# EAGLE design receiver (EAGLE 7.2.0)
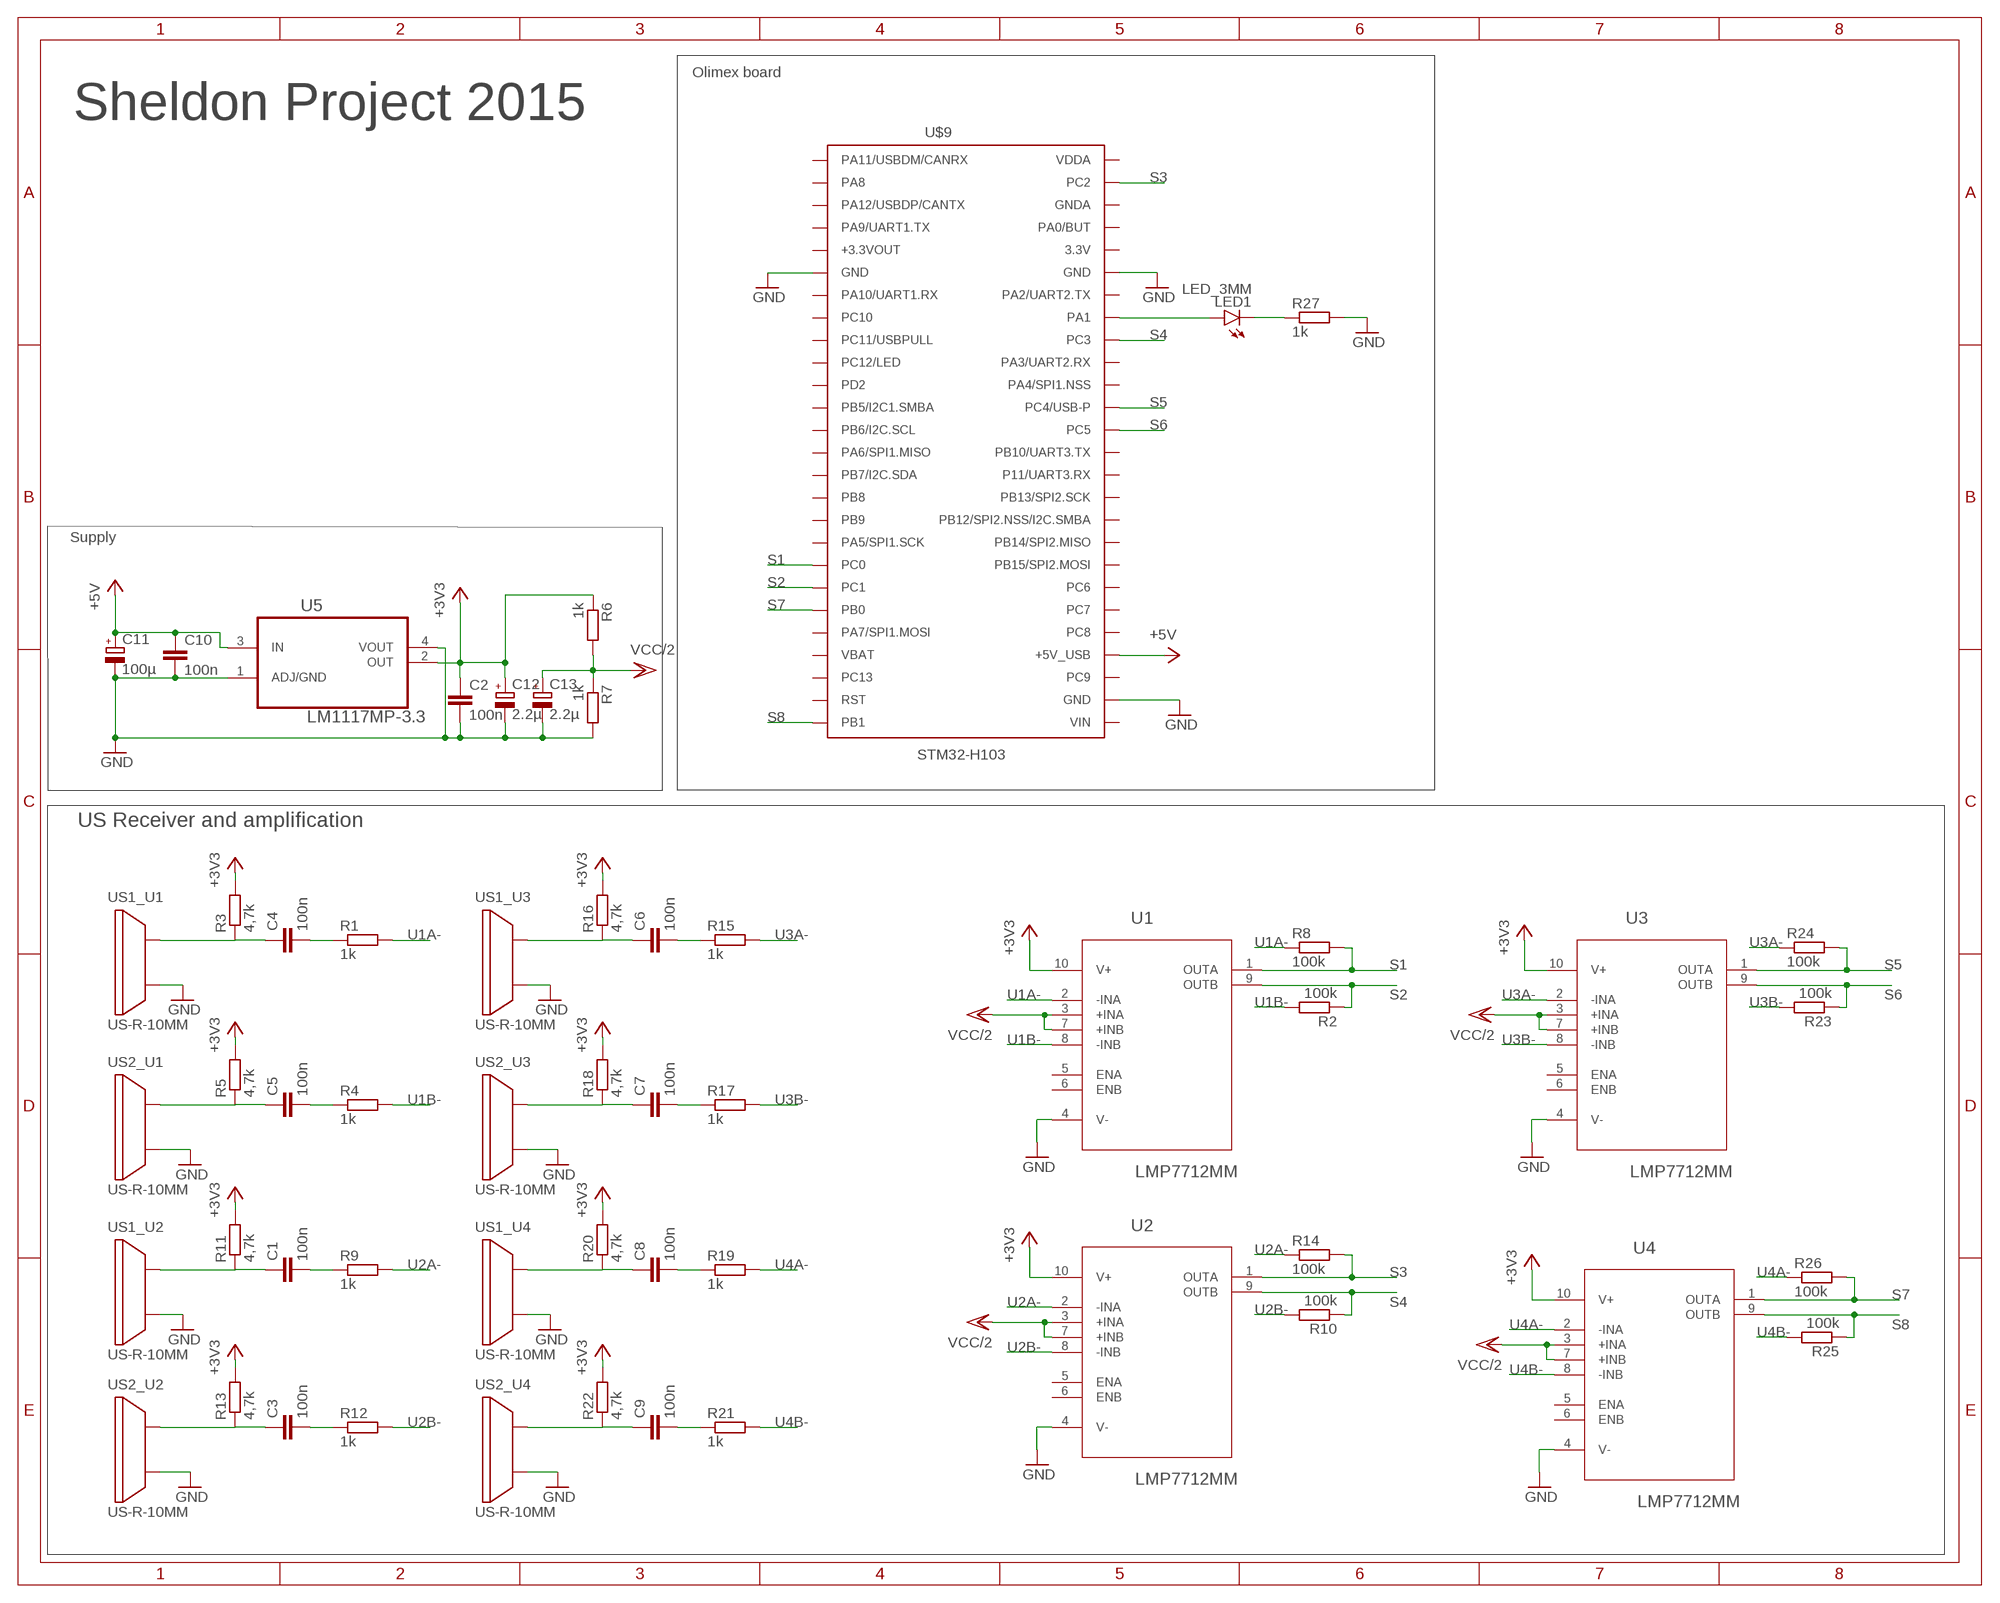
[diagram p0: schematic, sheet 1]

## Parts
C1  100n  C-EUC0603  [C0603]
C2  100n  C-EUC0603  [C0603]
C3  100n  C-EUC0603  [C0603]
C4  100n  C-EUC0603  [C0603]
C5  100n  C-EUC0603  [C0603]
C6  100n  C-EUC0603  [C0603]
C7  100n  C-EUC0603  [C0603]
C8  100n  C-EUC0603  [C0603]
C9  100n  C-EUC0603  [C0603]
C10  100n  C-EUC0603  [C0603]
C11  100µ  CPOL_DIAM5MM  [E2,5-6]
C12  2.2µ  CPOL_DIAM5MM  [E2,5-6]
C13  2.2µ  CPOL_DIAM5MM  [E2,5-6]
LED1  LED_3MM  [LED3MM]
R1  1k  R-EU_R0603  [R0603]
R2  100k  R-EU_R0603  [R0603]
R3  4,7k  R-EU_R0603  [R0603]
R4  1k  R-EU_R0603  [R0603]
R5  4,7k  R-EU_R0603  [R0603]
R6  1k  R-EU_R0603  [R0603]
R7  1k  R-EU_R0603  [R0603]
R8  100k  R-EU_R0603  [R0603]
R9  1k  R-EU_R0603  [R0603]
R10  100k  R-EU_R0603  [R0603]
R11  4,7k  R-EU_R0603  [R0603]
R12  1k  R-EU_R0603  [R0603]
R13  4,7k  R-EU_R0603  [R0603]
R14  100k  R-EU_R0603  [R0603]
R15  1k  R-EU_R0603  [R0603]
R16  4,7k  R-EU_R0603  [R0603]
R17  1k  R-EU_R0603  [R0603]
R18  4,7k  R-EU_R0603  [R0603]
R19  1k  R-EU_R0603  [R0603]
R20  4,7k  R-EU_R0603  [R0603]
R21  1k  R-EU_R0603  [R0603]
R22  4,7k  R-EU_R0603  [R0603]
R23  100k  R-EU_R0603  [R0603]
R24  100k  R-EU_R0603  [R0603]
R25  100k  R-EU_R0603  [R0603]
R26  100k  R-EU_R0603  [R0603]
R27  1k  R-EU_R0603  [R0603]
U1  LMP7712MM  [SOP50P490X110-10N]
U2  LMP7712MM  [SOP50P490X110-10N]
U3  LMP7712MM  [SOP50P490X110-10N]
U4  LMP7712MM  [SOP50P490X110-10N]
U5  LM1117MP-3.3  [SOT230P696X180-4N]
U$9  STM32-H103  [STM32-H103]
US1_U1  US-R-10MM  [US-R-10MM]
US1_U2  US-R-10MM  [US-R-10MM]
US1_U3  US-R-10MM  [US-R-10MM]
US1_U4  US-R-10MM  [US-R-10MM]
US2_U1  US-R-10MM  [US-R-10MM]
US2_U2  US-R-10MM  [US-R-10MM]
US2_U3  US-R-10MM  [US-R-10MM]
US2_U4  US-R-10MM  [US-R-10MM]

## Nets
+3V3: C2.1 C12.+ R3.2 R5.2 R6.1 R11.2 R13.2 R16.2 R18.2 R20.2 R22.2 U1.10(V+) U2.10(V+) U3.10(V+) U4.10(V+) U5.2(OUT)
+5V: C10.1 C11.+ U5.3(IN) U$9.+5V_USB
GND: C2.2 C10.2 C11.- C12.- C13.- R7.2 R27.2 U1.4(V-) U2.4(V-) U3.4(V-) U4.4(V-) U5.1(ADJ/GND) U5.4(VOUT) U$9.GND@1(GND) U$9.GND@2(GND) U$9.GND@3(GND) US1_U1.P$2 US1_U2.P$2 US1_U3.P$2 US1_U4.P$2 US2_U1.P$2 US2_U2.P$2 US2_U3.P$2 US2_U4.P$2
N$1: C1.1 R11.1 US1_U2.P$1
N$2: C1.2 R9.1
N$3: C4.1 R3.1 US1_U1.P$1
N$4: C4.2 R1.1
N$5: C5.1 R5.1 US2_U1.P$1
N$6: C5.2 R4.1
N$7: C3.1 R13.1 US2_U2.P$1
N$8: C3.2 R12.1
N$9: C6.1 R16.1 US1_U3.P$1
N$10: C6.2 R15.1
N$11: C7.1 R18.1 US2_U3.P$1
N$12: C7.2 R17.1
N$13: C8.1 R20.1 US1_U4.P$1
N$14: C8.2 R19.1
N$15: C9.1 R22.1 US2_U4.P$1
N$16: C9.2 R21.1
N$17: LED1.A U$9.PA1
N$18: LED1.K(C) R27.1
S1: R8.2 U1.1(OUTA) U$9.PC0
S2: R2.1 U1.9(OUTB) U$9.PC1
S3: R14.2 U2.1(OUTA) U$9.PC2
S4: R10.1 U2.9(OUTB) U$9.PC3
S5: R24.2 U3.1(OUTA) U$9.PC4/USB-P
S6: R23.1 U3.9(OUTB) U$9.PC5
S7: R26.2 U4.1(OUTA) U$9.PB0
S8: R25.1 U4.9(OUTB) U$9.PB1
U1A-: R1.2 R8.1 U1.2(-INA)
U1B-: R2.2 R4.2 U1.8(-INB)
U2A-: R9.2 R14.1 U2.2(-INA)
U2B-: R10.2 R12.2 U2.8(-INB)
U3A-: R15.2 R24.1 U3.2(-INA)
U3B-: R17.2 R23.2 U3.8(-INB)
U4A-: R19.2 R26.1 U4.2(-INA)
U4B-: R21.2 R25.2 U4.8(-INB)
VCC/2: C13.+ R6.2 R7.1 U1.3(+INA) U1.7(+INB) U2.3(+INA) U2.7(+INB) U3.3(+INA) U3.7(+INB) U4.3(+INA) U4.7(+INB)
Unconnected: U1.5(ENA) U1.6(ENB) U2.5(ENA) U2.6(ENB) U3.5(ENA) U3.6(ENB) U4.5(ENA) U4.6(ENB) U$9.3.3V U$9.+3.3VOUT U$9.GNDA U$9.P11/UART3.RX U$9.PA0/BUT U$9.PA2/UART2.TX U$9.PA3/UART2.RX U$9.PA4/SPI1.NSS U$9.PA5/SPI1.SCK U$9.PA6/SPI1.MISO U$9.PA7/SPI1.MOSI U$9.PA8 U$9.PA9/UART1.TX U$9.PA10/UART1.RX U$9.PA11/USBDM/CANRX U$9.PA12/USBDP/CANTX U$9.PB5/I2C1.SMBA U$9.PB6/I2C.SCL U$9.PB7/I2C.SDA U$9.PB8 U$9.PB9 U$9.PB10/UART3.TX U$9.PB12/SPI2.NSS/I2C.SMBA U$9.PB13/SPI2.SCK U$9.PB14/SPI2.MISO U$9.PB15/SPI2.MOSI U$9.PC6 U$9.PC7 U$9.PC8 U$9.PC9 U$9.PC10 U$9.PC11/USBPULL U$9.PC12/LED U$9.PC13 U$9.PD2 U$9.RST U$9.VBAT U$9.VDDA U$9.VIN

## Notes on the sheet
- Olimex board
- Sheldon Project 2015
- Supply
- US Receiver and amplification

## Library data of the parts
C1-C10 = resistor:C-EU: CAPACITOR, European symbol
C11-C13 = @Club_passif:CPOL_
LED1 = @Club_passif:LED_: LEDs, lumière quoi ! 1.8V < Vseuil < 2.0V environ
R1-R27 = resistor:R-EU_: RESISTOR, European symbol
U1-U4 = libSheldonDrone:LMP7712MM: CMOS Input Amplifiers; MPN: LMP7712MM; OC_FARNELL: 1312609; OC_NEWARK: 31M5302; PACKAGE: MSOP-10; SUPPLIER: National Semiconductors
U5 = libSheldonDrone:LM1117MP-3.3: Linear regulators; MPN: LM1117MP-3.3; OC_FARNELL: 9778195; OC_NEWARK: 41K3470; PACKAGE: SOT223-3; SUPPLIER: NationalSemiconductor
U$9 = libSheldonDrone:STM32-H103: Olimex STM32-H103 board
US1_U1-US1_U4 US2_U1-US2_U4 = libSheldonDrone:US-R-10MM: Ultrasound receiver diameter 10mm; FARNELL: 2362668

## Board
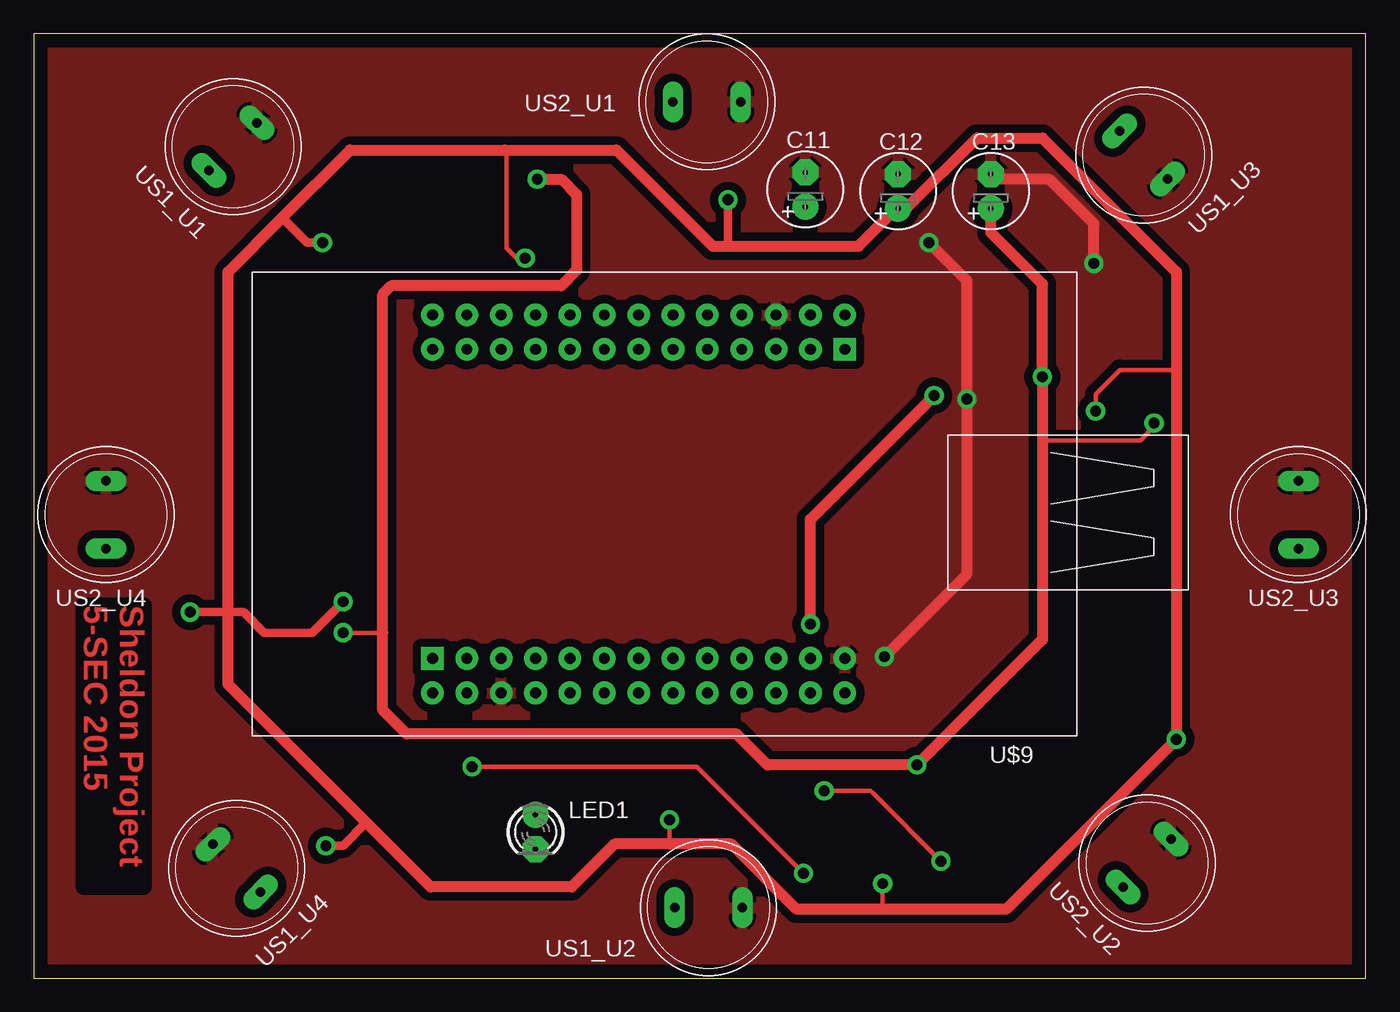
[diagram p1: board, top side]
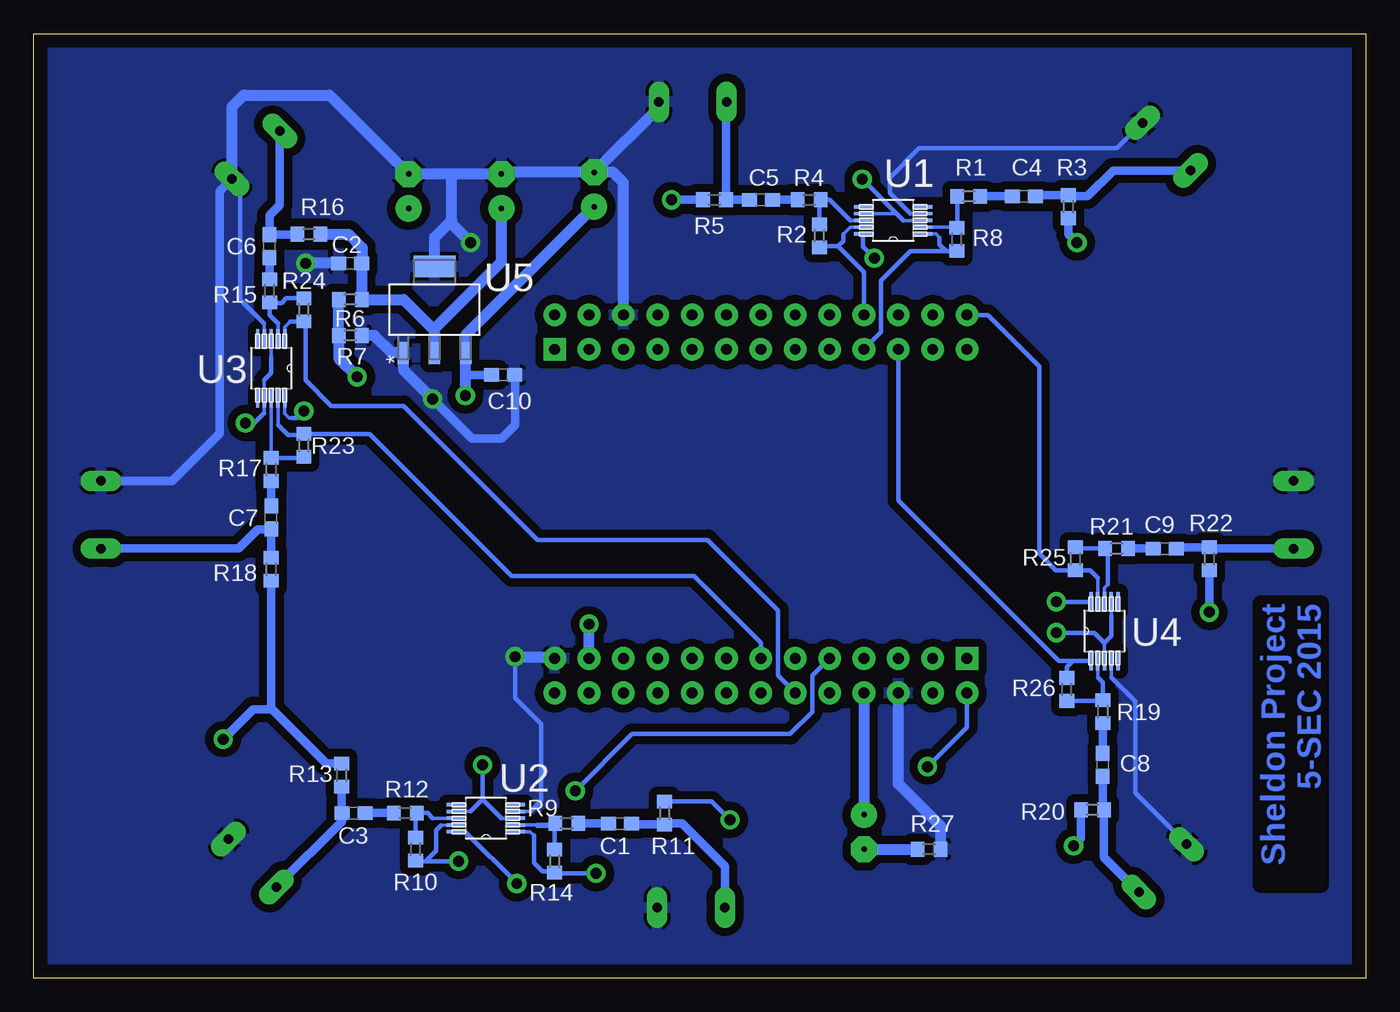
[diagram p2: board, bottom side, seen from below]

Size 98.44 x 69.8 mm. Coordinates in mm from the lower left corner, seen from the top.
Outline: 0,0 98.44,0 98.44,69.8 0,69.8 0,0
Copper layers (1*16): Top 0.035mm / dielectric 1.5mm / Bottom 0.035mm
Design rules "default *": minimum track width 0.15mm, minimum drill 24mil, track to track 0.1mm, track to pad 0.1mm, pad to pad 0.1mm, via to via 0.1mm, smd to smd 0.1mm, copper to edge 40mil, drill to drill 8mil, minimum pad ring 10mil, minimum via ring 8mil, stop-mask expansion 4mil, vias tented up to drill 0mil, thermal gap 10mil

### Footprints (pad centres in the part's own frame; a part is rotated, then mirrored left to right if it is on the bottom)
C0603 = smd 1.1 x 1: 1 -0.85,0; 2 0.85,0
E2,5-6 = drill 0.406 pad 1.93: + -1.27,0 | drill 0.406 pad 1.93 octagon: - 1.27,0
LED3MM = drill 0.406 pad 1.93: A -1.27,0 | drill 0.406 pad 1.93 octagon: K 1.27,0
R0603 = smd 1 x 1.1: 1 -0.85,0; 2 0.85,0
SOP50P490X110-10N = smd 1.4 x 0.25: 1 -2.2,1; 2 -2.2,0.5; 3 -2.2,0; 4 -2.2,-0.5; 5 -2.2,-1; 6 2.2,-1; 7 2.2,-0.5; 8 2.2,0; 9 2.2,0.5; 10 2.2,1
SOT230P696X180-4N = smd 1.6 x 0.838: 1 -3.2,2.311; 2 -3.2,0; 3 -3.2,-2.311 | smd 1.6 x 3.099: 4 3.2,0
STM32-H103 = drill 0.8 pad 1.676: 3.3V 25.4,-2.54; +3.3VOUT 5.08,-25.4; +5V_USB 2.54,-2.54; GND@1 5.08,-27.94; GND@2 25.4,0; GND@3 0,-2.54; GNDA 27.94,-2.54; P11/UART3.RX 12.7,-2.54; PA0/BUT 27.94,0; PA1 22.86,0; PA2/UART2.TX 22.86,-2.54; PA3/UART2.RX 20.32,0; PA4/SPI1.NSS 17.78,-2.54; PA5/SPI1.SCK 20.32,-27.94; PA6/SPI1.MISO 15.24,-27.94; PA7/SPI1.MOSI 25.4,-27.94; PA8 0,-27.94; PA9/UART1.TX 2.54,-27.94; PA10/UART1.RX 7.62,-25.4; PA12/USBDP/CANTX 2.54,-25.4; PB0 25.4,-25.4; PB1 30.48,-27.94; PB5/I2C1.SMBA 12.7,-27.94; PB6/I2C.SCL 15.24,-25.4; PB7/I2C.SDA 17.78,-25.4; PB8 17.78,-27.94; PB9 20.32,-25.4; PB10/UART3.TX 15.24,0; PB12/SPI2.NSS/I2C.SMBA 10.16,-2.54; PB13/SPI2.SCK 12.7,0; PB14/SPI2.MISO 10.16,0; PB15/SPI2.MOSI 7.62,-2.54; PC0 22.86,-25.4; PC1 22.86,-27.94; PC2 30.48,0; PC3 20.32,-2.54; PC4/USB-P 17.78,0; PC5 15.24,-2.54; PC6 7.62,0; PC7 5.08,-2.54; PC8 5.08,0; PC9 2.54,0; PC10 7.62,-27.94; PC11/USBPULL 10.16,-25.4; PC12/LED 10.16,-27.94; PC13 27.94,-27.94; PD2 12.7,-25.4; RST 30.48,-25.4; VBAT 27.94,-25.4; VIN 0,0 | drill 0.8 pad 1.676 square: PA11/USBDM/CANRX 0,-25.4; VDDA 30.48,-2.54
US-R-10MM = drill 0.7 pad 1.5 long: P$1 0,0; P$2 0,-5

### Placement (x,y rotation side)
C1  55.12,11.43 180 bottom
C2  75.06,52.83 180 bottom
C3  74.8,12.19 0 bottom
C4  25.27,57.78 180 bottom
C5  44.7,57.53 0 bottom
C6  81.03,54.1 270 bottom
C7  80.9,34.04 90 bottom
C8  19.43,15.75 90 bottom
C9  14.86,31.75 180 bottom
C10  63.75,44.58 0 bottom
C11  57.02,58.29 90 top
C12  63.88,58.17 90 top
C13  70.74,58.17 90 top
LED1  37.08,10.79 270 top
R1  29.34,57.78 180 bottom
R2  40.39,54.86 90 bottom
R3  21.97,57.02 270 bottom
R4  41.15,57.53 0 bottom
R5  48.13,57.53 180 bottom
R6  75.06,50.16 180 bottom
R7  75.06,47.5 0 bottom
R8  30.23,54.61 270 bottom
R9  59.05,11.43 180 bottom
R10  70.23,9.53 90 bottom
R11  51.82,12.19 90 bottom
R12  70.99,12.19 0 bottom
R13  75.69,14.99 90 bottom
R14  59.94,8.64 270 bottom
R15  81.03,50.8 270 bottom
R16  78.11,54.99 0 bottom
R17  80.9,37.59 90 bottom
R18  80.9,30.23 270 bottom
R19  19.43,19.68 90 bottom
R20  20.19,12.45 180 bottom
R21  18.41,31.75 180 bottom
R22  11.56,30.99 270 bottom
R23  78.49,39.37 270 bottom
R24  78.49,49.4 270 bottom
R25  21.46,30.99 90 bottom
R26  22.1,21.34 90 bottom
R27  32.26,9.53 0 bottom
U1  34.92,56.01 180 bottom
U2  65.02,11.81 180 bottom
U3  80.9,45.09 270 bottom
U4  19.3,25.65 90 bottom
U5  68.83,49.4 90 bottom
U$9  59.94,21.08 180 top
US1_U1  12.95,59.69 135 top
US1_U2  47.37,5.21 90 top
US1_U3  80.26,62.61 45 top
US1_U4  16.76,6.35 225 top
US2_U1  47.24,64.77 90 top
US2_U2  80.52,6.73 135 top
US2_U3  93.47,31.75 180 top
US2_U4  5.33,31.75 180 top

### Tracks (layer width: path | path; a pad name or v marks a point on that pad's centre or on a via)
+3V3  (via drill 0.8 pad 1.42)
  Top 0.33: v78.49,41.91 78.49,43.18 80.26,44.96 84.45,44.96 | v62.74,6.99 62.74,5.21 62.61,5.08 | v46.99,11.68 46.99,9.91 | v36.32,53.21 35.69,53.21 34.92,53.98 34.92,61.09 34.8,61.21
  Top 0.61: v11.56,27.05 14.35,27.05 15.49,27.05 17.02,25.53 20.57,25.53 v22.86,27.81 | v21.59,9.78 22.86,9.78 24.57,11.49 | v21.34,54.36 20.19,54.36 18.35,56.2 | v51.31,57.53 51.31,54.23 51.44,54.1
  Top 0.813: C12.+ 64.52,56.9 69.72,62.1 74.55,62.1 84.45,52.2 84.45,44.96 v84.45,17.65 71.88,5.08 62.61,5.08 56.39,5.08 51.56,9.91 46.99,9.91 42.93,9.91 39.75,6.73 29.34,6.73 24.57,11.49 14.35,21.72 14.35,27.05 14.35,52.2 18.35,56.2 23.37,61.21 34.8,61.21 43.05,61.21 50.16,54.1 51.44,54.1 60.96,54.1 63.75,56.9 C12.+
  Bottom 0.25: U2.10 66.57,10.82 | 20.34,27.81 U4.10 | U3.10 79.9,41.74 79.56,41.4 79.38,41.4 | U1.10 37.12,54.77 37.15,54.75
  Bottom 0.33: 79.38,41.4 78.99,41.4 v78.49,41.91 | 66.57,10.82 v62.74,6.99 | R11.2 48.35,13.04 v46.99,11.68 | v22.86,27.81 20.34,27.81 | v36.32,53.21 37.13,54.03 37.15,54.04 37.15,54.75
  Bottom 0.61: R18.2 80.9,19.94 80.83,19.88 | 80.83,19.88 76.83,15.88 75.73,15.88 R13.2 | v84.45,17.65 82.23,19.88 80.83,19.88 | R22.2 v11.56,27.05 | R20.2 21.04,10.33 v21.59,9.78 | R3.2 21.97,54.99 v21.34,54.36 | R5.2 v51.31,57.53
  Bottom 0.813: U5.2 68.83,47.88 | 68.83,47.88 68.83,48.01 63.88,52.96 C12.+ | 68.83,47.88 71.12,50.16 R6.1 C2.1 74.17,52.87 74.17,53.98 75.18,54.99 R16.2
+5V  (via drill 0.8 pad 1.42)
  Top 0.813: v57.4,26.16 57.4,33.91 66.42,42.93 v66.55,43.05
  Bottom 0.61: C10.1 66.42,44.58 66.55,44.7
  Bottom 0.813: U$9.+5V_USB v57.4,26.16 | v66.55,43.05 66.55,44.7 66.55,46.18 U5.3 66.52,47.52 C11.+
GND  (via drill 0.8 pad 1.42)
  Top 0.813: v78.36,52.83 78.36,55.75 75.06,59.05 71.12,59.05 C13.- | v62.87,23.75 68.96,29.84 v68.96,42.8 68.96,51.56 v66.17,54.36
  Bottom 0.25: U2.4 61.72,12.32 | U3.4 81.41,48.39 | U4.4 18.8,22.23 | U1.4 33.66,56.52
  Bottom 0.33: 61.72,12.32 60.96,13.08 60.96,18.8 62.87,20.7 v62.87,23.75 | 81.41,48.39 83.19,50.16 83.19,58.46 US1_U3.P$2 | 18.8,22.23 17.02,20.45 17.02,13.68 US1_U4.P$2 | 33.66,56.52 35.18,58.04 35.18,59.18 33.02,61.34 18.37,61.34 US1_U1.P$2
  Bottom 0.61: US2_U3.P$2 88.22,36.75 84.71,40.26 84.71,58.17 US1_U3.P$2 | v68.96,42.8 66.04,39.88 63.88,39.88 62.87,40.89 62.87,44.54 C10.2
  Bottom 0.813: R7.2 73.28,47.5 72.01,46.23 71.37,46.23 71.35,46.2 U5.1 71.14,44.98 v68.96,42.8 | C11.- 63.75,59.56 C12.- 67.31,59.44 | 67.31,59.44 C13.- | U5.4 68.83,54.74 67.69,55.88 | 67.69,55.88 67.56,56.01 67.56,59.18 67.31,59.44 | U$9.GND@1 54.86,58.8 55.63,59.56 C11.- | US2_U1.P$2 52.24,64.34 C11.- | US1_U3.P$2 83.8,64.41 82.93,65.28 76.58,65.28 C13.- | C2.2 v78.36,52.83 | 71.12,59.05 C13.- | v62.87,23.75 60.07,23.75 U$9.GND@3 | v66.17,54.36 67.69,55.88 | R27.2 31.41,11.21 34.54,14.35 U$9.GND@2
  pour Bottom (isolate 0.61): -1.91,73.15 106.3,73.15 106.3,-3.56 -2.03,-3.56 -2.03,73.15
  pour Top (isolate 0.61): -7.11,78.23 111.63,78.23 111.63,-8.89 -7.11,-8.89
N$1
  Bottom 0.61: US1_U2.P$1 47.37,8.26 50.55,11.43 51.73,11.43 R11.1 54.18,11.34 C1.1
N$2
  Bottom 0.61: C1.2 R9.1
N$3
  Bottom 0.61: US1_U1.P$1 18.67,59.69 20.57,57.78 21.88,57.78 R3.1 24.34,57.87 C4.1
N$4
  Bottom 0.61: C4.2 R1.1
N$5
  Bottom 0.61: C5.1 R5.1 47.28,64.73 US2_U1.P$1
N$6
  Bottom 0.61: R4.1 C5.2
N$7
  Bottom 0.61: R13.1 75.69,12.23 C3.1 75.65,11.6 US2_U2.P$1
N$8
  Bottom 0.61: R12.1 C3.2
N$9
  Bottom 0.61: R16.1 78.99,54.95 C6.1 81.03,56.39 80.26,57.15 US1_U3.P$1
N$10
  Bottom 0.61: R15.1 C6.2
N$11
  Bottom 0.61: R18.1 C7.1 80.94,33.15 81.92,33.15 83.31,31.75 US2_U3.P$1
N$12
  Bottom 0.61: R17.1 C7.2
N$13
  Bottom 0.61: US1_U4.P$1 19.34,8.93 R20.1 19.43,12.53 C8.1
N$14
  Bottom 0.61: C8.2 R19.1
N$15
  Bottom 0.61: US2_U4.P$1 11.47,31.75 R22.1 13.92,31.84 C9.1
N$16
  Bottom 0.61: C9.2 R21.1
N$17
  Bottom 0.813: U$9.PA1 LED1.A
N$18
  Bottom 0.813: LED1.K R27.1
S1
  Bottom 0.25: U1.1 31.77,55.02 31.5,54.74
  Bottom 0.33: 31.5,54.74 31.5,54.23 30.99,53.72 | 30.99,53.72 30.27,53.72 R8.2 | U$9.PC0 35.81,47.75 35.81,51.56 33.66,53.72 30.99,53.72
S2
  Bottom 0.25: U1.9 38.1,55.5 38.61,54.99
  Bottom 0.33: 38.61,54.99 38.61,54.48 38.99,54.1 | 38.99,54.1 40.3,54.1 R2.1 | U$9.PC1 37.08,52.2 38.99,54.1
S3  (via drill 0.8 pad 1.42)
  Top 0.33: v32.38,15.62 49.02,15.62 v56.9,7.75
  Bottom 0.25: U2.1 61.75,10.82 61.47,10.54
  Bottom 0.33: 61.47,10.54 61.47,8.51 60.83,7.87 60.03,7.87 R14.2 59.91,7.75 v56.9,7.75 | U$9.PC2 29.46,18.54 v32.38,15.62
S4  (via drill 0.8 pad 1.42)
  Top 0.33: v67.06,8.64 61.98,13.72 61.85,13.84 v58.42,13.84
  Bottom 0.25: U2.9 68.33,11.3
  Bottom 0.33: 68.33,11.3 68.71,10.92 68.71,9.4 69.47,8.64 70.19,8.64 | 70.19,8.64 R10.1 70.19,8.64 | U$9.PC3 40.89,22.35 40.89,19.68 42.55,18.03 54.23,18.03 v58.42,13.84 | v67.06,8.64 70.19,8.64
S5
  Bottom 0.25: U3.1 79.9,48.12 79.5,48.51
  Bottom 0.33: 79.5,48.51 78.53,48.51 R24.2 78.36,48.43 78.36,44.2 76.45,42.29 71.12,42.29 61.21,32.38 48.64,32.38 43.43,27.18 43.43,22.35 U$9.PC4/USB-P
S6
  Bottom 0.25: U3.9 80.39,40.89
  Bottom 0.33: 80.39,40.89 79.63,40.13 78.57,40.13 R23.1 73.62,40.22 63.12,29.72 49.66,29.72 44.7,24.77 U$9.PC5
S7
  Bottom 0.25: U4.1 20.55,23.45
  Bottom 0.33: 21.64,23.44 22.1,22.99 R26.2 | 21.64,23.44 22.68,23.44 34.54,35.31 U$9.PB0 | 20.55,23.45 21.64,23.45 21.64,23.44
S8
  Bottom 0.25: 19.81,29.59 U4.9
  Bottom 0.33: 19.81,29.59 20.36,30.14 R25.1 22.9,30.14 24.13,31.37 24.13,45.21 27.94,49.02 U$9.PB1
U1A-
  Bottom 0.25: U1.2 30.27,55.5
  Bottom 0.33: R1.2 30.19,55.75 R8.1 30.27,55.5
U1B-
  Bottom 0.25: U1.8 38.1,56.01
  Bottom 0.33: 38.1,56.01 39.62,57.53 R4.2 40.39,57.44 R2.2
U2A-
  Bottom 0.25: U2.2 61.21,11.31 61.21,11.3
  Bottom 0.33: 60.03,11.3 R9.2 59.94,11.39 R14.1
  Bottom 0.406: 61.21,11.3 59.91,11.3 R9.2
U2B-
  Bottom 0.25: U2.8 68.96,11.81
  Bottom 0.33: R10.2 70.23,12.1 R12.2 69.34,12.19 68.96,11.81
U3A-
  Bottom 0.25: U3.2 80.39,48.39
  Bottom 0.33: 80.39,48.39 81.03,49.02 R15.2 80.99,49.91 80.14,49.91 79.8,50.25 R24.1
U3B-
  Bottom 0.25: U3.8 R17.2
  Bottom 0.33: R17.2 78.56,38.44 R23.2
U4A-
  Bottom 0.25: 19.81,22.23 U4.2
  Bottom 0.33: 19.81,22.23 19.43,21.84 R19.2 19.48,20.49 R26.1
U4B-
  Bottom 0.25: U4.8 19.3,28.85 19.05,29.1
  Bottom 0.33: 19.3,31.71 R21.2 | R21.2 21.38,31.75 R25.2 | 19.05,29.1 19.05,31.54 R21.2
VCC/2  (via drill 0.8 pad 1.42)
  Top 0.33: v82.8,41.02 82.8,40.77 81.79,39.75 74.55,39.75 | v22.86,25.53 25.78,25.53
  Top 0.813: C13.+ 70.74,55.12 74.55,51.31 v74.55,44.45 74.55,39.75 74.55,25.02 v65.28,15.75 54.23,15.75 51.94,18.03 27.56,18.03 25.78,19.81 25.78,25.53 25.78,50.55 26.42,51.18 38.99,51.18 40.13,52.32 40.13,57.91 38.99,59.05 v37.21,59.05
  Bottom 0.25: 66.17,12.32 U2.7 | U2.3 63.88,11.81 | 81.41,44.2 81.41,42.93 | 81.41,42.93 U3.7 | 81.41,42.93 81.41,41.78 | 34.16,56.01 U1.3 | U4.3 19.3,24.77 | U1.7 34.67,56.52 | U3.3 80.9,45.9 | U4.7 18.8,26.75
  Bottom 0.33: v65.28,15.75 65.28,13.21 | 65.28,13.21 66.17,12.32 | 63.88,11.81 65.28,13.21 | 81.41,44.2 80.9,44.7 80.9,45.9 | 81.41,41.78 82.17,41.02 v82.8,41.02 | 34.16,56.01 34.67,56.52 v37.21,59.05 | v22.86,25.53 20.07,25.53 19.3,24.77 18.8,25.27 18.8,25.28 18.8,26.75
  Bottom 0.813: R6.2 R7.1 75.91,45.81 v74.55,44.45

### Text on the board
Top: Sheldon Project / 5-SEC 2015
Bottom: Sheldon Project / 5-SEC 2015